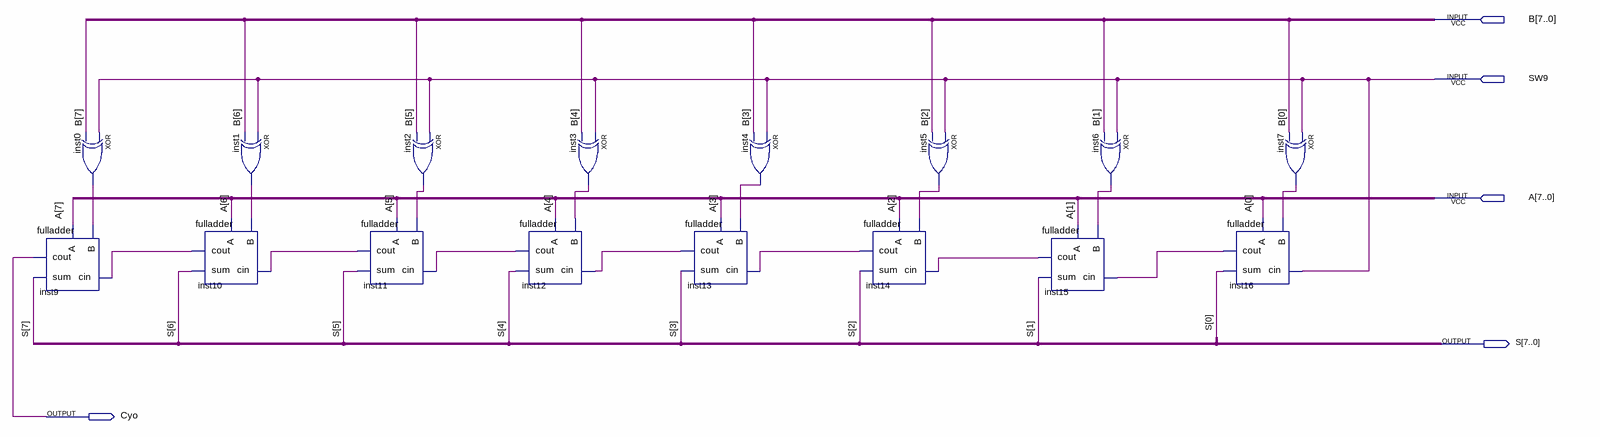
[diagram p0: schematic sheet]
// Quartus schematic eightBit.bdf as structural Verilog: 16 symbols, 5 pins
module eightBit (
  input  [7:0] B,
  input  SW9,
  input  [7:0] A,
  output [7:0] S,
  output Cyo
);

  wire inst0_out, inst1_out, inst2_out, inst3_out, inst4_out, inst5_out, inst6_out, inst7_out, inst10_cout,
       inst11_cout, inst12_cout, inst13_cout, inst14_cout, inst15_cout, inst16_cout;

  xor inst0 (inst0_out, SW9, B[7]);
  fulladder inst9 (.cin(inst10_cout), .B(inst0_out), .A(A[7]), .sum(S[7]), .cout(Cyo));
  xor inst1 (inst1_out, SW9, B[6]);
  fulladder inst10 (.cin(inst11_cout), .B(inst1_out), .A(A[6]), .sum(S[6]), .cout(inst10_cout));
  fulladder inst11 (.cin(inst12_cout), .B(inst2_out), .A(A[5]), .sum(S[5]), .cout(inst11_cout));
  xor inst2 (inst2_out, SW9, B[5]);
  fulladder inst12 (.cin(inst13_cout), .B(inst3_out), .A(A[4]), .sum(S[4]), .cout(inst12_cout));
  xor inst3 (inst3_out, SW9, B[4]);
  fulladder inst13 (.cin(inst14_cout), .B(inst4_out), .A(A[3]), .sum(S[3]), .cout(inst13_cout));
  xor inst4 (inst4_out, SW9, B[3]);
  fulladder inst14 (.cin(inst15_cout), .B(inst5_out), .A(A[2]), .sum(S[2]), .cout(inst14_cout));
  xor inst5 (inst5_out, SW9, B[2]);
  fulladder inst15 (.cin(inst16_cout), .B(inst6_out), .A(A[1]), .sum(S[1]), .cout(inst15_cout));
  xor inst6 (inst6_out, SW9, B[1]);
  fulladder inst16 (.cin(SW9), .B(inst7_out), .A(A[0]), .sum(S[0]), .cout(inst16_cout));
  xor inst7 (inst7_out, SW9, B[0]);
endmodule
